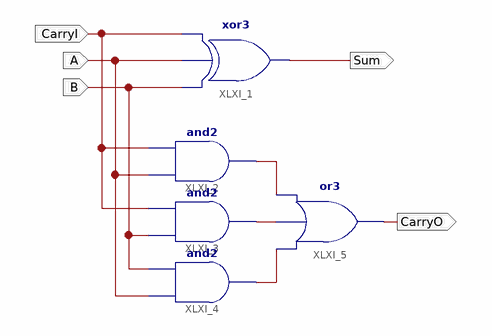
[diagram p0: schematic sheet 1]
// Xilinx ISE schematic Bit3Adder.sch (spartan3e) as structural Verilog: 5 symbols, 5 ports
module Bit3Adder (
  input  CarryI,
  input  A,
  input  B,
  output Sum,
  output CarryO
);

  wire XLXN_6, XLXN_7, XLXN_8;

  xor XLXI_1 (Sum, B, A, CarryI);
  and XLXI_2 (XLXN_6, A, CarryI);
  and XLXI_3 (XLXN_7, B, CarryI);
  and XLXI_4 (XLXN_8, A, B);
  or XLXI_5 (CarryO, XLXN_8, XLXN_7, XLXN_6);
endmodule
